# EAGLE design V0 (EAGLE 6.5.0)
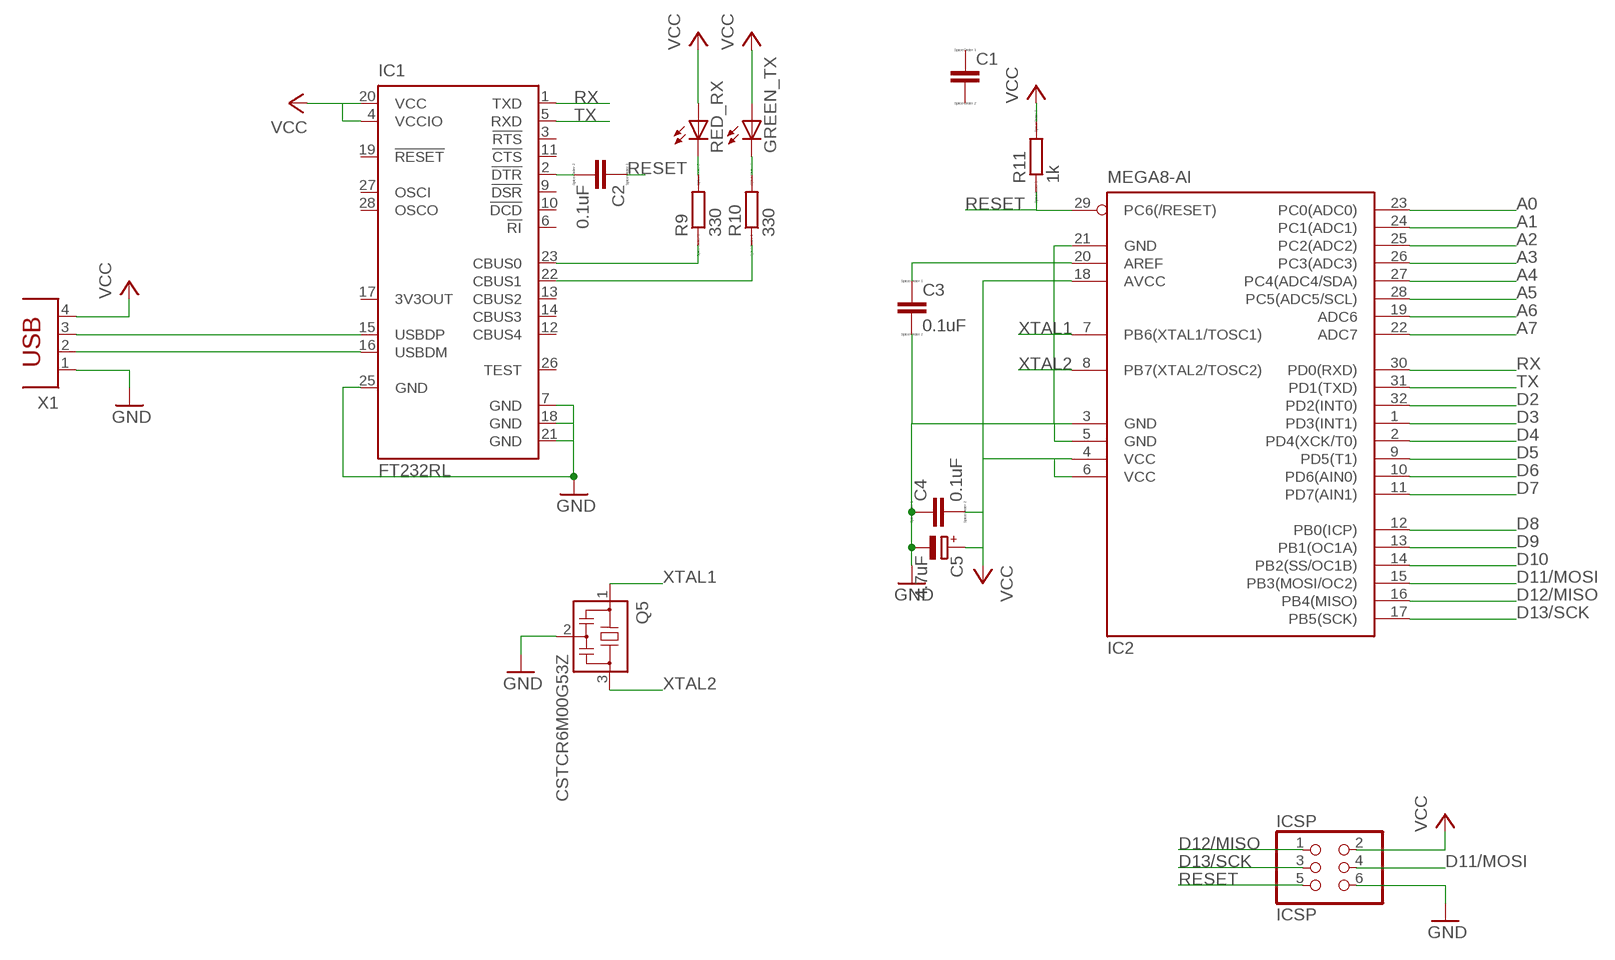
[diagram p0: schematic, sheet 1, part 1 of 2]
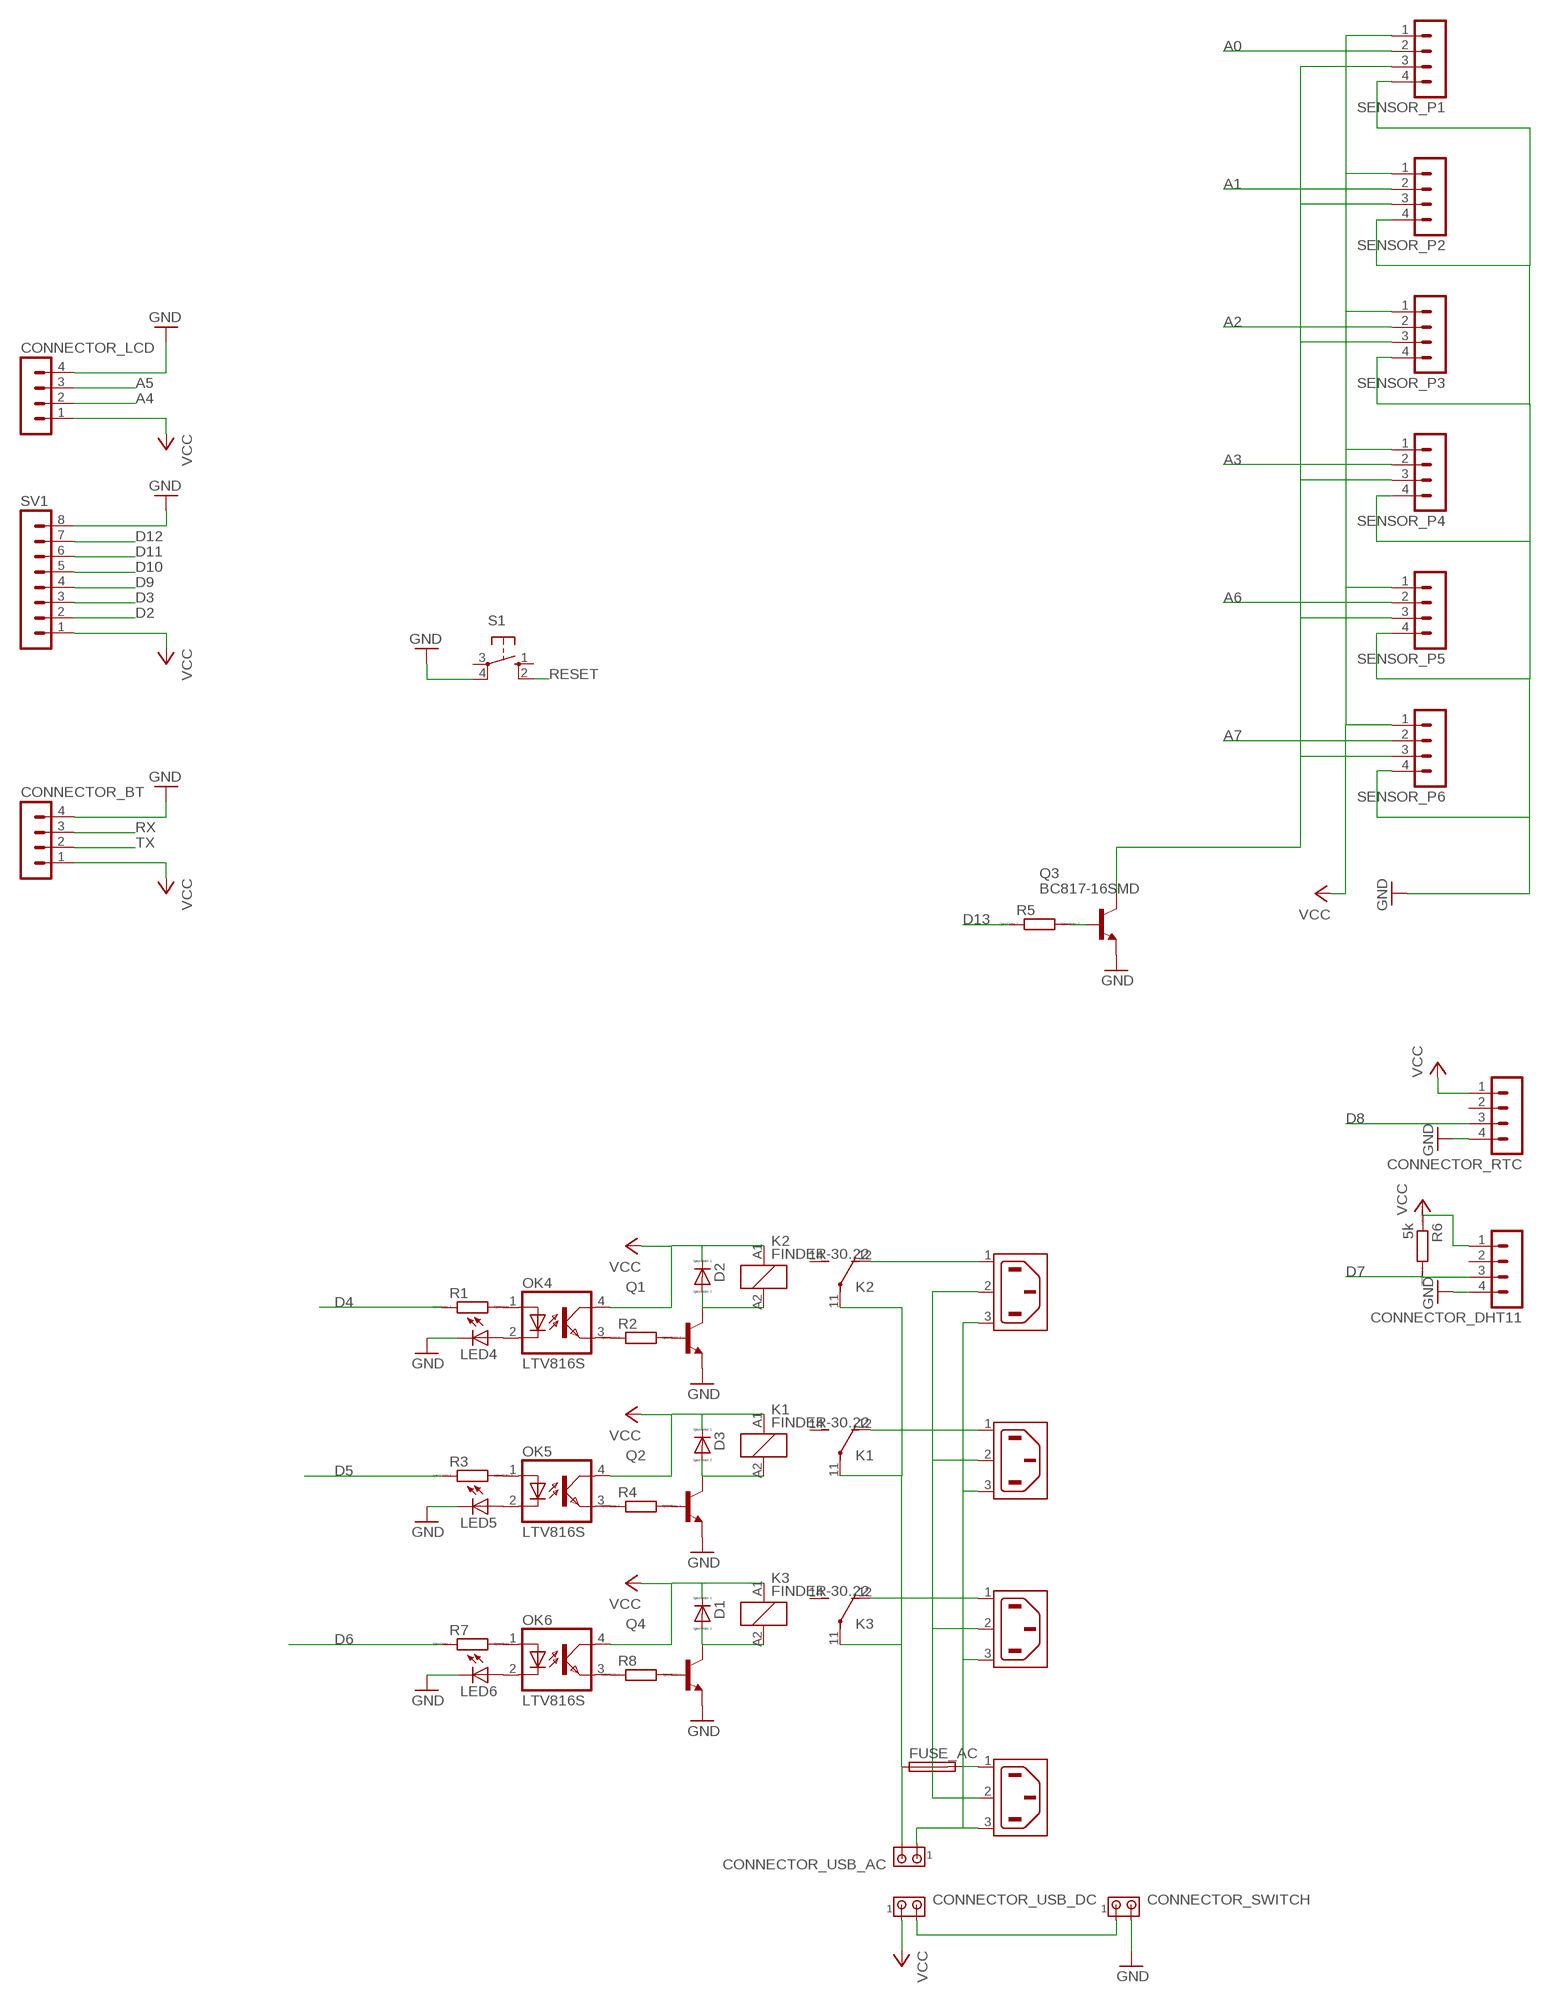
[diagram p1: schematic, sheet 1, part 2 of 2]

## Parts
C1  C  [C0805]
C2  0.1uF  C  [C0805]
C3  0.1uF  C  [C0805]
C4  0.1uF  C  [C0805]
C5  4.7uF  CPOL-EU085CS-1AW  [085CS_1AW]
CONNECTOR_BT  MA04-1  [MA04-1]
CONNECTOR_DHT11  MA04-1  [MA04-1]
CONNECTOR_LCD  MA04-1  [MA04-1]
CONNECTOR_RTC  MA04-1  [MA04-1]
CONNECTOR_SWITCH  MTA02-100  [10X02MTA]
CONNECTOR_USB_AC  MTA02-100  [10X02MTA]
CONNECTOR_USB_DC  MTA02-100  [10X02MTA]
D1  DIODE_E-  [DIODE_SMB]
D2  DIODE_E-  [DIODE_SMB]
D3  DIODE_E-  [DIODE_SMB]
FUSE_AC  SH22,5  [SH22,5]
GREEN_TX  LEDCHIPLED_0805  [CHIPLED_0805]
IC1  FT232RL  [SSOP28]
IC2  MEGA8-AI  [TQFP32-08]
ICSP  ICSP  PINHD-2X3_2.54-SMD  [2X03SMD]
IN_AC  6ESRM-P  [6ESRM-P]
K1  FINDER-30.22  [FINDER-30.22]
K2  FINDER-30.22  [FINDER-30.22]
K3  FINDER-30.22  [FINDER-30.22]
LED4  LEDCHIPLED_0805  [CHIPLED_0805]
LED5  LEDCHIPLED_0805  [CHIPLED_0805]
LED6  LEDCHIPLED_0805  [CHIPLED_0805]
OK4  LTV816S  [SMD4]
OK5  LTV816S  [SMD4]
OK6  LTV816S  [SMD4]
OUT_LIGHT  6ESRM-P  [6ESRM-P]
OUT_PUMP  6ESRM-P  [6ESRM-P]
OUT_PUMP1  6ESRM-P  [6ESRM-P]
Q1  BC847ASMD  [SOT23]
Q2  BC847ASMD  [SOT23]
Q3  BC817-16SMD  [SOT23-BEC]
Q4  BC847ASMD  [SOT23]
Q5  CSTCR6M00G53Z  [CSTCR6M]
R1  R  [R0805]
R2  R  [R0805]
R3  R  [R0805]
R4  R  [R0805]
R5  R  [R0805]
R6  5k  R  [R0805]
R7  R  [R0805]
R8  R  [R0805]
R9  330  R  [R0805]
R10  330  R  [R0805]
R11  1k  R  [R0805]
RED_RX  LEDCHIPLED_0805  [CHIPLED_0805]
S1  10-XX  [B3F-10XX]
SENSOR_P1  MA04-1  [MA04-1]
SENSOR_P2  MA04-1  [MA04-1]
SENSOR_P3  MA04-1  [MA04-1]
SENSOR_P4  MA04-1  [MA04-1]
SENSOR_P5  MA04-1  [MA04-1]
SENSOR_P6  MA04-1  [MA04-1]
SV1  MA08-1  [MA08-1]
X1  PN61729  [PN61729]

## Nets
A0: IC2.23(PC0(ADC0)) SENSOR_P1.2
A1: IC2.24(PC1(ADC1)) SENSOR_P2.2
A2: IC2.25(PC2(ADC2)) SENSOR_P3.2
A3: IC2.26(PC3(ADC3)) SENSOR_P4.2
A4: CONNECTOR_LCD.2 IC2.27(PC4(ADC4/SDA))
A5: CONNECTOR_LCD.3 IC2.28(PC5(ADC5/SCL))
A6: IC2.19(ADC6) SENSOR_P5.2
A7: IC2.22(ADC7) SENSOR_P6.2
D2: IC2.32(PD2(INT0)) SV1.2
D3: IC2.1(PD3(INT1)) SV1.3
D4: IC2.2(PD4(XCK/T0)) R1.1
D5: IC2.9(PD5(T1)) R3.1
D6: IC2.10(PD6(AIN0)) R7.1
D7: CONNECTOR_DHT11.3 IC2.11(PD7(AIN1)) R6.2
D8: CONNECTOR_RTC.3 IC2.12(PB0(ICP))
D9: IC2.13(PB1(OC1A)) SV1.4
D10: IC2.14(PB2(SS/OC1B)) SV1.5
D11: SV1.6
D11/MOSI: IC2.15(PB3(MOSI/OC2)) ICSP.4
D12: SV1.7
D12/MISO: IC2.16(PB4(MISO)) ICSP.1
D13: R5.1
D13/SCK: IC2.17(PB5(SCK)) ICSP.3
GND: C3.2 C4.1 C5.- CONNECTOR_BT.4 CONNECTOR_DHT11.4 CONNECTOR_LCD.4 CONNECTOR_RTC.4 CONNECTOR_SWITCH.2 IC1.7(GND) IC1.18(GND) IC1.21(GND) IC1.25(GND) IC2.3(GND) IC2.5(GND) IC2.21(GND) ICSP.6 LED4.C LED5.C LED6.C Q1.2(E) Q2.2(E) Q3.E Q4.2(E) Q5.2 S1.4(P1) SENSOR_P1.4 SENSOR_P2.4 SENSOR_P3.4 SENSOR_P4.4 SENSOR_P5.4 SENSOR_P6.4 SV1.8 X1.1
N$1: OK4.1(A) R1.2
N$2: OK5.1(A) R3.2
N$3: OK6.1(A) R7.2
N$4: D2.A(C) K2.A2 Q1.3(C)
N$5: R9.2 RED_RX.C
N$6: Q1.1(B) R2.2
N$7: CONNECTOR_USB_AC.2 FUSE_AC.1 K1.11(-1:P) K2.11(-1:P) K3.11(-1:P)
N$8: IN_AC.2(SH) OUT_LIGHT.2(SH) OUT_PUMP1.2(SH) OUT_PUMP.2(SH)
N$9: LED4.A OK4.2(C)
N$10: FUSE_AC.2 IN_AC.1(AC1)
N$12: LED5.A OK5.2(C)
N$13: LED6.A OK6.2(C)
N$14: D3.A(C) K1.A2 Q2.3(C)
N$15: GREEN_TX.C R10.2
N$16: Q2.1(B) R4.2
N$17: K1.12(-1:O) OUT_PUMP.1(AC1)
N$18: K2.12(-1:O) OUT_LIGHT.1(AC1)
N$19: CONNECTOR_USB_AC.1 IN_AC.3(AC2) OUT_LIGHT.3(AC2) OUT_PUMP1.3(AC2) OUT_PUMP.3(AC2)
N$24: Q3.C SENSOR_P1.3 SENSOR_P2.3 SENSOR_P3.3 SENSOR_P4.3 SENSOR_P5.3 SENSOR_P6.3
N$25: Q3.B R5.2
N$28: OK4.3(EMIT) R2.1
N$31: OK5.3(EMIT) R4.1
N$36: C2.2 IC1.2(!DTR)
N$37: IC1.23(CBUS0) R9.1
N$38: OK6.3(EMIT) R8.1
N$42: D1.A(C) K3.A2 Q4.3(C)
N$43: IC1.22(CBUS1) R10.1
N$44: Q4.1(B) R8.2
N$46: K3.12(-1:O) OUT_PUMP1.1(AC1)
N$47: CONNECTOR_SWITCH.1 CONNECTOR_USB_DC.2
N$53: IC1.15(USBDP) X1.3
N$54: IC1.16(USBDM) X1.2
N$55: C3.1
RESET: C2.1 IC2.29(PC6(/RESET)) ICSP.5 R11.1 S1.2(S1)
RX: CONNECTOR_BT.3 IC1.1(TXD) IC2.30(PD0(RXD))
TX: CONNECTOR_BT.2 IC1.5(RXD) IC2.31(PD1(TXD))
VCC: C4.2 C5.+ CONNECTOR_BT.1 CONNECTOR_DHT11.1 CONNECTOR_LCD.1 CONNECTOR_RTC.1 CONNECTOR_USB_DC.1 D1.C(A) D2.C(A) D3.C(A) GREEN_TX.A IC1.4(VCCIO) IC1.20(VCC) IC2.4(VCC) IC2.6(VCC) ICSP.2 K1.A1 K2.A1 K3.A1 OK4.4(COL) OK5.4(COL) OK6.4(COL) R6.1 R11.2 RED_RX.A SENSOR_P1.1 SENSOR_P2.1 SENSOR_P3.1 SENSOR_P4.1 SENSOR_P5.1 SENSOR_P6.1 SV1.1 X1.4
XTAL1: IC2.7(PB6(XTAL1/TOSC1)) Q5.1
XTAL2: IC2.8(PB7(XTAL2/TOSC2)) Q5.3
Unconnected: C1.1 C1.2 CONNECTOR_DHT11.2 CONNECTOR_RTC.2 IC1.3(!RTS) IC1.6(!RI) IC1.9(!DSR) IC1.10(!DCD) IC1.11(!CTS) IC1.12(CBUS4) IC1.13(CBUS2) IC1.14(CBUS3) IC1.17(3V3OUT) IC1.19(!RESET) IC1.26(TEST) IC1.27(OSCI) IC1.28(OSCO) IC2.20(AREF) K1.14(-1:S) K1.21(-2:P) K1.22(-2:O) K1.24(-2:S) K2.14(-1:S) K2.21(-2:P) K2.22(-2:O) K2.24(-2:S) K3.14(-1:S) K3.21(-2:P) K3.22(-2:O) K3.24(-2:S) S1.1(S) S1.3(P)

## Power pins joined to a net without a drawn wire
AVCC: IC2.18(AVCC)

## Library data of the parts
C1-C4 = eagle-ltspice:C: CAPACITOR, European symbol; SPICEMODEL: NONE; SPICEPREFIX: C
C5 = rcl:CPOL-EU: POLARIZED CAPACITOR, European symbol
CONNECTOR_BT CONNECTOR_DHT11 CONNECTOR_LCD CONNECTOR_RTC SENSOR_P1-SENSOR_P6 = con-lstb:MA04-1: PIN HEADER; OC_FARNELL: unknown; OC_NEWARK: unknown
CONNECTOR_SWITCH CONNECTOR_USB_AC CONNECTOR_USB_DC = con-amp:MTA02-100: AMP connector
D1-D3 = eagle-ltspice:DIODE_E-: Schottky Diode; SPICEMODEL: diode; SPICEPREFIX: D
FUSE_AC = fuse:SH22,5: FUSE HOLDER grid 22,5 mm, OGN0031 8201, Schurter (Buerklin); MF: SCHURTER; MPN: 0031.8201; OC_FARNELL: 1162740; OC_NEWARK: 96F8317
GREEN_TX LED4-LED6 RED_RX = led:LED: LED OSRAM: - CHIPLED LG R971, LG N971, LY N971, LG Q971, LY Q971, LO R971, LY R971 LH N974, LH R974 LS Q976, LO Q976, LY Q976 LO Q996 - Hyper CHIPLED LW Q18S LB Q993, LB Q99A, LB R99A - SideLED LS A670, LO A670, LY A670, LG A670, LP A670 LB A673, LV A673, LT A673, LW A673 LH A674 LY A675 LS A676, LA A676, LO A676, LY A676, LW A676 LS A679, LY A679, LG A679 - Hyper Micro SIDELED® LS Y876, LA Y876, LO Y876, LY Y876 LT Y87S - SmartLED LW L88C, LW L88S LB L89C, LB L89S, LG L890 LS L89K, LO L89K, LY L89K LS L896, LA L896, LO L896, LY L896 - TOPLED LS T670, LO T670, LY T670, LG T670, LP T670 LSG T670, LSP T670, LSY T670, LOP T670, LYG T670 LG T671, LOG T671, LSG T671 LB T673, LV T673, LT T673, LW T673 LH T674 LS T676, LA T676, LO T676, LY T676, LB T676, LH T676, LSB T676, LW T676 LB T67C, LV T67C, LT T67C, LS T67K, LO T67K, LY T67K, LW E67C LS E67B, LA E67B, LO E67B, LY E67B, LB E67C, LV E67C, LT E67C LW T67C LS T679, LY T679, LG T679 LS T770, LO T770, LY T770, LG T770, LP T770 LB T773, LV T773, LT T773, LW T773 LH T774 LS E675, LA E675, LY E675, LS T675 LS T776, LA T776, LO T776, LY T776, LB T776 LHGB T686 LT T68C, LB T68C - Hyper Mini TOPLED® LB M676 - Mini TOPLED Santana® LG M470 LS M47K, LO M47K, LY M47K Source: http://www.osram.convergy.de LUXEON: - LUMILED® LXK2-PW12-R00, LXK2-PW12-S00, LXK2-PW14-U00, LXK2-PW14-V00 LXK2-PM12-R00, LXK2-PM12-S00, LXK2-PM14-U00 LXK2-PE12-Q00, LXK2-PE12-R00, LXK2-PE12-S00, LXK2-PE14-T00, LXK2-PE14-U00 LXK2-PB12-K00, LXK2-PB12-L00, LXK2-PB12-M00, LXK2-PB14-N00, LXK2-PB14-P00, LXK2-PB14-Q00 LXK2-PR12-L00, LXK2-PR12-M00, LXK2-PR14-Q00, LXK2-PR14-R00 LXK2-PD12-Q00, LXK2-PD12-R00, LXK2-PD12-S00 LXK2-PH12-R00, LXK2-PH12-S00 LXK2-PL12-P00, LXK2-PL12-Q00, LXK2-PL12-R00 Source: www.luxeon.com KINGBRIGHT: KA-3528ASYC Source: www.kingbright.com
IC1 = ftdichip:FT232R: Source: http://www.ftdichip.com/Documents/DataSheets/DS_FT232R_v104.pdf; MPN: FT232RL; OC_FARNELL: 1146032; OC_NEWARK: 91K9918
IC2 = atmel:MEGA8: MICROCONTROLLER 8 Kbytes FLASH, 1 kbytes SRAM, 512 bytes EEPROM, USART, 6-channel 10 bit ADC, 2-channel 8 bit ADC Pin compatible with Atmega48, ATMega88, ATMega168 Source: avr.lbr; MPN: ATMEGA8-16AU; OC_FARNELL: 9171371; OC_NEWARK: 73M8863
ICSP = pinhead_smd:PINHD-2X3: PIN HEADER
IN_AC OUT_LIGHT OUT_PUMP OUT_PUMP1 = con-tycoelectronics:6ESRM-P: AC Connector 120/250 VAC Source: http://catalog.tycoelectronics.com .. ENG_DS_1654001_1099_SR_0406.pdf; MF: TYCO ELECTRONICS; MPN: 6ESRM-P; OC_FARNELL: unknown; OC_NEWARK: 87F1821
K1-K3 = relay:FINDER-30.22: SUBMINIATURE DIL-RELAIS FINDER 30.22.9.024.0000 Kontakt max. AC - 125V Distributor: Farnell Bestell Nr.: 1217371 Source: http://www.farnell.com/datasheets/87634.pdf; OC_FARNELL: unknown; OC_NEWARK: unknown
OK4-OK6 = optocoupler:LTV816: OPTO COUPLER Source: LITEON, LTV816.pdf; OC_FARNELL: unknown; OC_NEWARK: unknown
Q1 Q2 Q4 = transistor-npn:BC847*: NPN Transistor
Q3 = transistor-npn:BC817*: NPN Transistor
Q5 = murata-filter:CSTCR: Resonator Source: murata.co.jp; MPN: CSTCR6M00G53-R0; OC_FARNELL: 1170434; OC_NEWARK: 25M8759
R1-R11 = eagle-ltspice:R: RESISTOR, European symbol; SPICEMODEL: NONE; SPICEPREFIX: R
S1 = switch-omron:10-XX: OMRON SWITCH; MPN: B3F-1000; OC_FARNELL: 176432; OC_NEWARK: 36M3542
SV1 = con-lstb:MA08-1: PIN HEADER; OC_FARNELL: unknown; OC_NEWARK: unknown
X1 = con-berg:PN61729: BERG USB connector; OC_FARNELL: unknown; OC_NEWARK: unknown

## Board
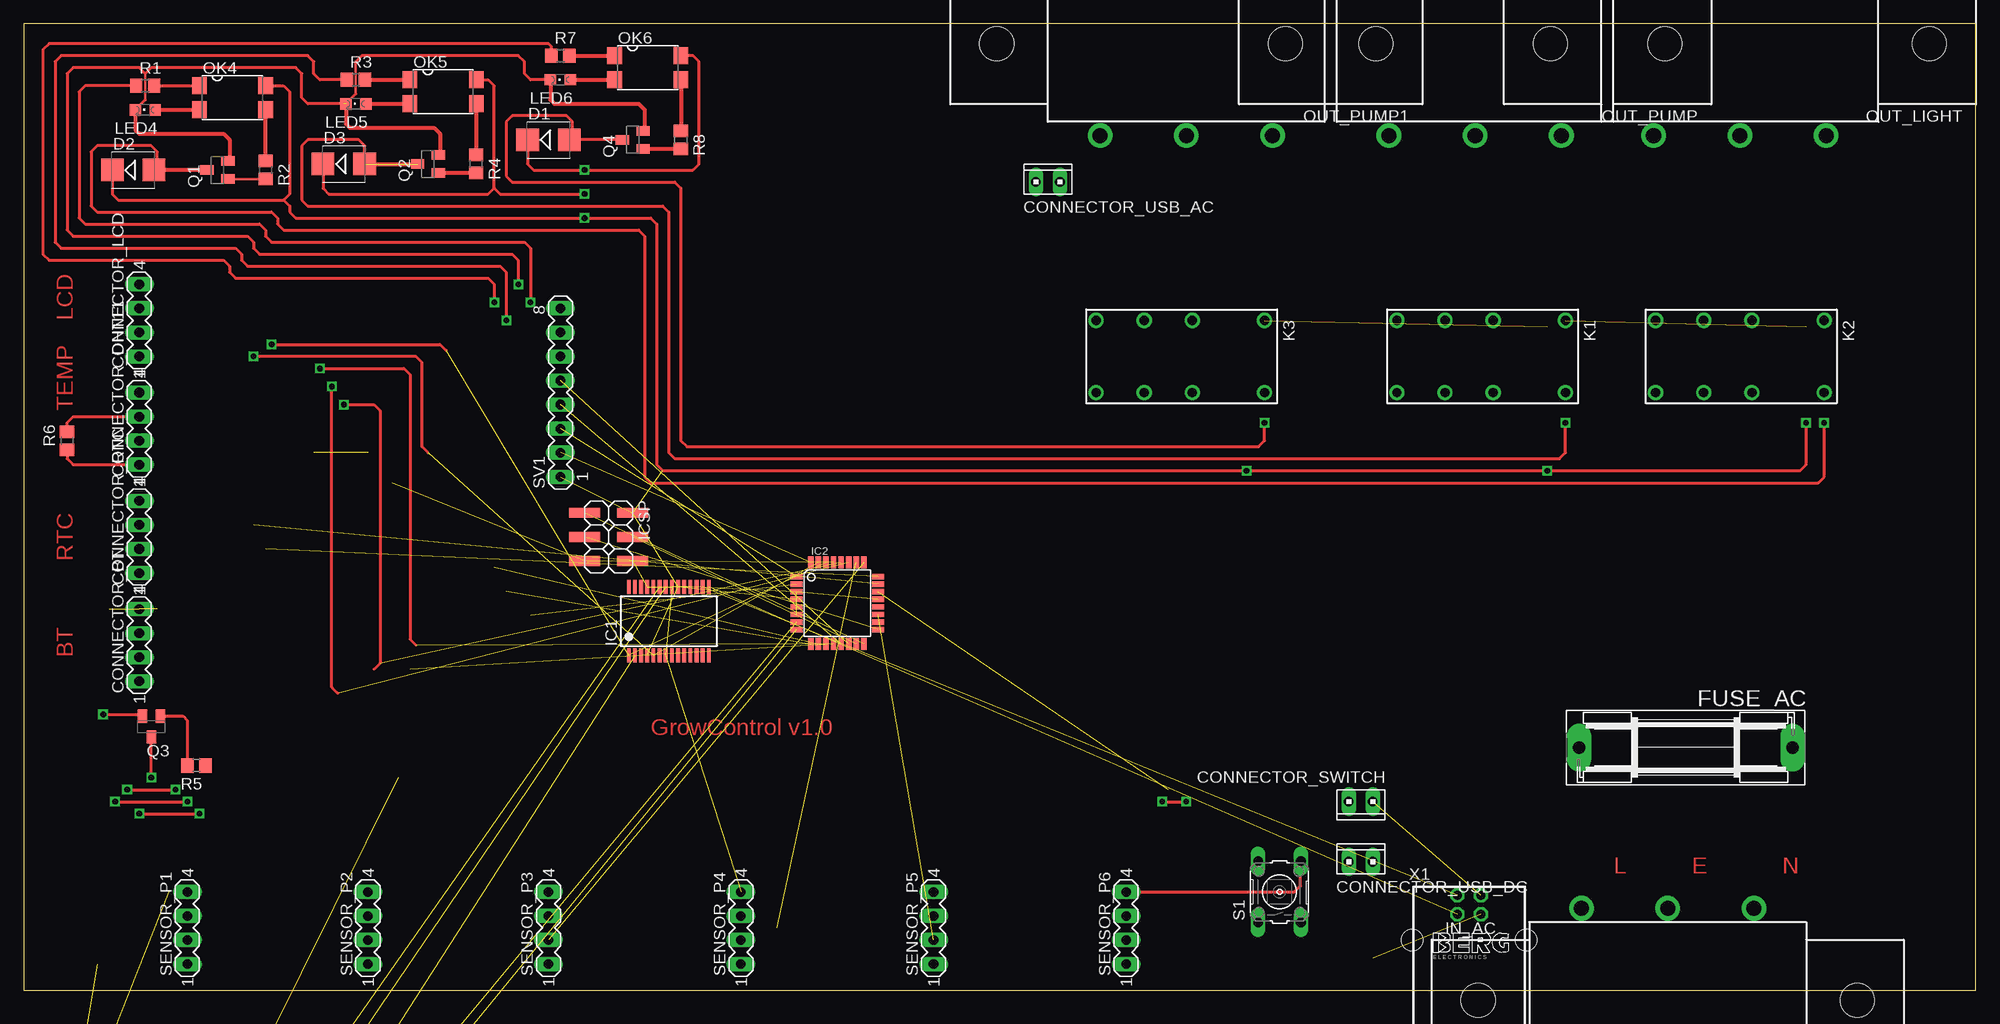
[diagram p2: board, top side]
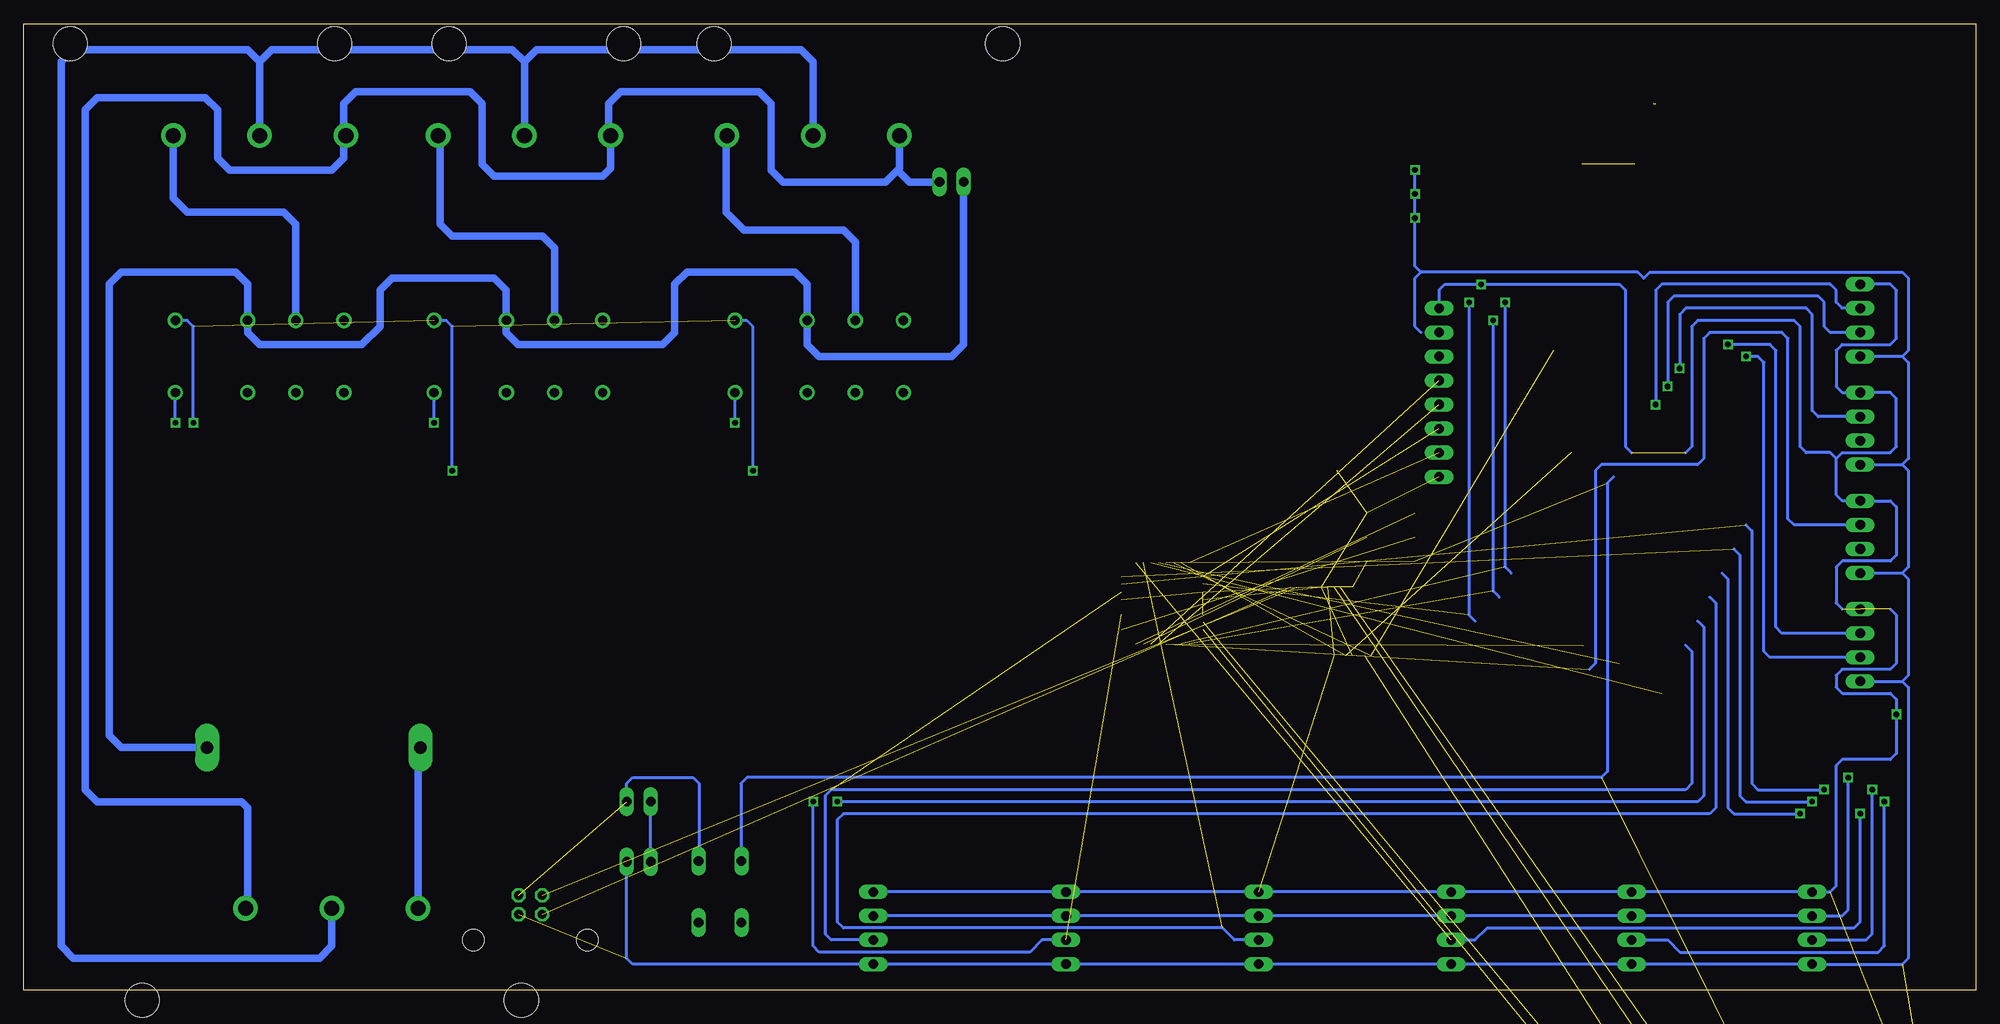
[diagram p3: board, bottom side, seen from below]

Size 206 x 102 mm. Coordinates in mm from the lower left corner, seen from the top.
Outline: 0,0 206,0 206,102 0,102 0,0
Copper layers (1*16): Top 0.035mm / dielectric 1.5mm / Bottom 0.035mm
Design rules "default": minimum track width 10mil, minimum drill 24mil, track to track 8mil, track to pad 8mil, pad to pad 8mil, via to via 8mil, smd to smd 8mil, copper to edge 40mil, drill to drill 8mil, minimum pad ring 10mil, minimum via ring 8mil, stop-mask expansion 4mil, vias tented up to drill 0mil, thermal gap 10mil

### Footprints (pad centres in the part's own frame; a part is rotated, then mirrored left to right if it is on the bottom)
C0805 = smd 1.3 x 1.5: 1 -0.95,0; 2 0.95,0
085CS_1AW = smd 4.7 x 3.7: + 4.45,0; - -4.45,0
MA04-1 = drill 1.016 long: 1 -3.81,0; 2 -1.27,0; 3 1.27,0; 4 3.81,0
10X02MTA = drill 1.016 long: 1 1.27,0; 2 -1.27,0
DIODE_SMB = smd 2.4 x 2.4: A 2.2,0; C -2.2,0
SH22,5 = drill 1.321 pad 2.54 long: 1 -11.252,0; 2 11.252,0
CHIPLED_0805 = smd 1.2 x 1.2: A 0,-1.05; C 0,1.05
SSOP28 = smd 0.4 x 1.5: 1 -4.225,-3.625; 2 -3.575,-3.625; 3 -2.925,-3.625; 4 -2.275,-3.625; 5 -1.625,-3.625; 6 -0.975,-3.625; 7 -0.325,-3.625; 8 0.325,-3.625; 9 0.975,-3.625; 10 1.625,-3.625; 11 2.275,-3.625; 12 2.925,-3.625; 13 3.575,-3.625; 14 4.225,-3.625; 15 4.225,3.625; 16 3.575,3.625; 17 2.925,3.625; 18 2.275,3.625; 19 1.625,3.625; 20 0.975,3.625; 21 0.325,3.625; 22 -0.325,3.625; 23 -0.975,3.625; 24 -1.625,3.625; 25 -2.275,3.625; 26 -2.925,3.625; 27 -3.575,3.625; 28 -4.225,3.625
TQFP32-08 = smd 1.27 x 0.559: 1 -4.293,2.8; 2 -4.293,2; 3 -4.293,1.2; 4 -4.293,0.4; 5 -4.293,-0.4; 6 -4.293,-1.2; 7 -4.293,-2; 8 -4.293,-2.8; 17 4.293,-2.8; 18 4.293,-2; 19 4.293,-1.2; 20 4.293,-0.4; 21 4.293,0.4; 22 4.293,1.2; 23 4.293,2; 24 4.293,2.8 | smd 0.559 x 1.27: 9 -2.8,-4.293; 10 -2,-4.293; 11 -1.2,-4.293; 12 -0.4,-4.293; 13 0.4,-4.293; 14 1.2,-4.293; 15 2,-4.293; 16 2.8,-4.293; 25 2.8,4.293; 26 2,4.293; 27 1.2,4.293; 28 0.4,4.293; 29 -0.4,4.293; 30 -1.2,4.293; 31 -2,4.293; 32 -2.8,4.293
2X03SMD = smd 1.016 x 3.302: 1 -1.27,-3.81; 2 -1.27,1.27; 3 1.27,-3.81; 4 1.27,1.27; 5 3.81,-3.81; 6 3.81,1.27
6ESRM-P = drill 1.6 pad 2.6: 1 -9.1,9.7; 2 0,9.7; 3 9.1,9.7 | hole 3.6: -20,0; 20,0
FINDER-30.22 = drill 1 pad 1.6: 11 -1.27,-3.81; 12 3.81,-3.81; 14 8.89,-3.81; 21 -1.27,3.81; 22 3.81,3.81; 24 8.89,3.81; A1 -8.89,-3.81; A2 -8.89,3.81
SMD4 = smd 1.78 x 1.55: 1 -1.27,-3.5; 2 1.27,-3.5; 3 1.27,3.5; 4 -1.27,3.5
SOT23 = smd 1 x 1.4: 1 -0.95,-1.1; 2 0.95,-1.1; 3 0,1.1
SOT23-BEC = smd 1 x 1.4: B -0.95,-1.1; C 0,1.1; E 0.95,-1.1
CSTCR6M = smd 0.8 x 2.6: 1 -1.5,0; 2 0,0; 3 1.5,0
R0805 = smd 1.3 x 1.5: 1 -0.95,0; 2 0.95,0
B3F-10XX = drill 1.016 long: 1 -3.251,2.261; 2 3.251,2.261; 3 -3.251,-2.261; 4 3.251,-2.261
MA08-1 = drill 1.016 long: 1 -8.89,0; 2 -6.35,0; 3 -3.81,0; 4 -1.27,0; 5 1.27,0; 6 3.81,0; 7 6.35,0; 8 8.89,0
PN61729 = drill 0.95 octagon: 1 1.25,4.71; 2 -1.25,4.71; 3 -1.25,2.71; 4 1.25,2.71 | hole 2.3: -6.02,0; 6.02,0

### Placement (x,y rotation side)
C1  2.03,-65.2 0 top  (outside the outline)
C2  -10.67,-80.44 0 top  (outside the outline)
C3  -26.54,-93.15 0 top  (outside the outline)
C4  -45.59,-99.5 0 top  (outside the outline)
C5  -43.69,-105.84 0 top  (outside the outline)
CONNECTOR_BT  12.19,36.39 90 top
CONNECTOR_DHT11  12.19,59.26 90 top
CONNECTOR_LCD  12.19,70.69 90 top
CONNECTOR_RTC  12.19,47.83 90 top
CONNECTOR_SWITCH  141.1,19.89 180 top
CONNECTOR_USB_AC  108.08,85.29 0 top
CONNECTOR_USB_DC  141.1,13.53 0 top
D1  55.38,89.73 0 top
D2  11.56,86.56 0 top
D3  33.78,87.19 0 top
FUSE_AC  175.39,25.6 180 top
GREEN_TX  -10.03,-63.94 0 top  (outside the outline)
IC1  68.08,38.94 0 top
IC2  85.86,40.84 0 top
ICSP  62.99,49.09 270 top
IN_AC  173.49,-1.07 0 top
K1  153.8,66.88 180 top
K2  181.11,66.88 180 top
K3  122.05,66.88 180 top
LED4  12.83,92.91 90 top
LED5  35.06,93.55 90 top
LED6  56.65,96.09 90 top
OK4  22.04,94.18 270 top
OK5  44.26,94.81 270 top
OK6  65.85,97.35 270 top
OUT_LIGHT  181.11,99.9 180 top
OUT_PUMP  153.16,99.9 180 top
OUT_PUMP1  122.69,99.9 180 top
Q1  20.45,86.56 90 top
Q2  42.67,87.19 90 top
Q3  13.47,27.82 180 top
Q4  64.27,89.73 90 top
Q5  -44.96,-114.74 0 top  (outside the outline)
R1  12.83,95.45 0 top
R2  25.53,86.56 270 top
R3  35.06,96.09 0 top
R4  47.76,87.19 270 top
R5  18.23,23.7 180 top
R6  4.58,57.98 90 top
R7  56.65,98.62 0 top
R8  69.34,89.73 270 top
R9  -10.67,-69.65 0 top  (outside the outline)
R10  -10.67,-74.09 0 top  (outside the outline)
R11  -26.54,-86.79 0 top  (outside the outline)
RED_RX  -3.68,-63.94 0 top  (outside the outline)
S1  132.53,10.36 90 top
SENSOR_P1  17.28,6.55 90 top
SENSOR_P2  36.33,6.55 90 top
SENSOR_P3  55.38,6.55 90 top
SENSOR_P4  75.69,6.55 90 top
SENSOR_P5  96.02,6.55 90 top
SENSOR_P6  116.34,6.55 90 top
SV1  56.65,63.06 90 top
X1  152.53,5.28 0 top

### Tracks (layer width: path | path; a pad name or v marks a point on that pad's centre or on a via)
A0  (via drill 0.6)  (1 unrouted)
  Top 0.305: v10.92,21.16 v16,21.16
  Bottom 0.305: SENSOR_P1.2 11.56,5.28 10.92,5.91 v10.92,21.16 | 24.26,49.09 23.62,48.46 23.62,21.79 22.99,21.16 v16,21.16
A1  (via drill 0.6)  (1 unrouted)
  Top 0.305: v9.66,19.89 v17.28,19.89
  Bottom 0.305: SENSOR_P2.2 32.52,5.28 31.25,4.01 10.29,4.01 9.66,4.65 v9.66,19.89 | 25.53,46.55 24.89,45.92 24.89,20.52 24.26,19.89 v17.28,19.89
A2  (via drill 0.6)  (1 unrouted)
  Top 0.305: v12.19,18.62 v18.55,18.62
  Bottom 0.305: SENSOR_P3.2 52.84,5.28 51.56,6.55 12.83,6.55 12.19,7.19 v12.19,18.62 | 26.8,44.02 26.17,43.38 26.17,19.25 25.53,18.62 v18.55,18.62
A3  (1 unrouted)
  Bottom 0.305: SENSOR_P4.2 78.23,5.28 79.5,6.55 119.51,6.55 120.14,7.19 120.14,17.98 119.51,18.62 28.07,18.62 27.44,19.25 27.44,40.84 28.07,41.48
A4  (via drill 0.6)  (1 unrouted)
  Top 0.305: 33.15,31.32 32.52,31.95 v32.52,63.7
  Bottom 0.305: CONNECTOR_LCD.2 15.37,69.41 16,70.05 16,72.59 16.64,73.22 31.88,73.22 32.52,72.59 v32.52,63.7
A5  (via drill 0.6)  (1 unrouted)
  Top 0.305: 36.96,33.86 37.59,34.49 37.59,61.16 36.96,61.8 v33.78,61.8
  Bottom 0.305: CONNECTOR_LCD.3 14.1,71.95 14.73,72.59 14.73,73.86 15.37,74.5 33.15,74.5 33.78,73.86 v33.78,61.8
A6  (via drill 0.6)  (1 unrouted)
  Top 0.305: v120.14,19.89 v122.69,19.89
  Bottom 0.305: SENSOR_P5.2 98.56,5.28 99.83,4.01 122.05,4.01 122.69,4.65 v122.69,19.89 | 29.34,38.94 28.7,38.3 28.7,20.52 29.34,19.89 v120.14,19.89
A7  (1 unrouted)
  Bottom 0.305: SENSOR_P6.2 120.78,5.28 121.41,5.91 121.41,20.52 120.78,21.16 30.61,21.16 29.97,21.79 29.97,35.76 30.61,36.39
D2  (1 unrouted)
D3  (1 unrouted)
D4  (via drill 0.6)  (1 unrouted)
  Top 0.305: R1.1 6.48,95.45 5.84,94.81 5.84,81.48 6.48,80.84 24.89,80.84 25.53,80.21 25.53,79.58 26.17,78.94 52.84,78.94 53.47,78.31 v53.47,72.59
  Bottom 0.305: v53.47,72.59 53.47,39.57 52.84,38.94
D5  (via drill 0.6)  (1 unrouted)
  Top 0.305: R3.1 31.25,96.09 30.61,96.72 30.61,97.99 29.97,98.62 3.94,98.62 3.31,97.99 3.31,78.94 3.94,78.31 22.36,78.31 22.99,77.67 22.99,77.03 23.62,76.4 50.3,76.4 50.93,75.77 v50.93,70.69
  Bottom 0.305: 50.3,41.48 50.93,42.11 v50.93,70.69
D6  (via drill 0.6)  (1 unrouted)
  Top 0.305: v49.66,72.59 49.66,74.5 49.02,75.13 22.36,75.13 21.72,75.77 21.72,76.4 21.08,77.03 2.67,77.03 2.03,77.67 2.03,99.26 2.67,99.9 55.38,99.9 55.7,99.58 R7.1
  Bottom 0.305: 49.02,44.02 49.66,44.65 v49.66,72.59
D7  (via drill 0.6)  (1 unrouted)
  Top 0.305: R6.2 4.58,59.89 5.21,60.52 CONNECTOR_DHT11.3 | v31.25,65.61 40.13,65.61 40.77,64.97 40.77,37.03 41.41,36.39
  Bottom 0.305: CONNECTOR_DHT11.3 16.64,60.52 17.28,61.16 17.28,71.32 17.91,71.95 30.61,71.95 31.25,71.32 v31.25,65.61
D8  (1 unrouted)
  Bottom 0.305: CONNECTOR_RTC.3 19.18,49.09 19.81,49.73 19.81,68.78 20.45,69.41 28.07,69.41 28.7,68.78 28.7,56.08 29.34,55.45 39.5,55.45 40.13,54.81 40.13,34.49 40.77,33.86
D9  (1 unrouted)
D10  (1 unrouted)
D11/MOSI  (1 unrouted)
D12/MISO  (1 unrouted)
D13/SCK  (1 unrouted)
GND  (via drill 0.6)  (17 unrouted)
  Top 0.254: 35.06,97.99 35.06,94.59 | 12.83,96.72 12.83,93.96
  Top 0.305: LED6.C 53.47,96.09 52.84,96.72 52.84,97.99 52.2,98.62 35.69,98.62 35.06,97.99 | 35.06,94.59 LED5.C | 33.78,93.55 29.97,93.55 29.34,94.18 29.34,96.72 28.7,97.35 13.47,97.35 12.83,96.72 12.19,97.35 5.21,97.35 4.58,96.72 4.58,80.21 5.21,79.58 23.62,79.58 24.26,78.94 24.26,78.31 24.89,77.67 51.56,77.67 52.2,77.03 v52.2,74.5 | 12.83,93.96 LED4.C | SENSOR_P6.4 134.12,10.36 134.75,10.99 134.75,13.57 S1.4 | v8.39,29.09 12.34,29.09 Q3.E
  Top 0.406: Q1.2 21.72,87.68 21.72,89.73 21.08,90.37 12.19,90.37 11.78,90.78 LED4.C | Q2.2 43.95,88.31 43.95,90.37 43.31,91 34.42,91 34,91.42 LED5.C | LED6.C 55.59,93.96 56.01,93.55 64.9,93.55 65.53,92.91 65.53,90.85 Q4.2
  Bottom 0.305: SENSOR_P6.4 SENSOR_P5.4 SENSOR_P4.4 SENSOR_P3.4 SENSOR_P2.4 SENSOR_P1.4 15.37,10.36 14.73,10.99 14.73,23.7 14.1,24.33 9.02,24.33 8.39,24.96 v8.39,29.09 8.39,30.68 9.02,31.32 14.1,31.32 14.73,31.95 14.73,33.22 14.1,33.86 9.02,33.86 8.39,34.49 8.39,39.57 9.02,40.2 | 14.73,56.08 14.73,52.27 14.1,51.63 CONNECTOR_RTC.4 9.02,51.63 8.39,51 8.39,45.92 9.02,45.28 14.1,45.28 14.73,44.65 14.73,40.84 14.1,40.2 | 14.73,56.08 14.1,56.72 9.02,56.72 8.39,57.35 8.39,62.43 9.02,63.06 CONNECTOR_DHT11.4 14.1,63.06 14.73,63.7 14.73,67.51 14.1,68.14 9.02,68.14 8.39,68.78 8.39,73.86 9.02,74.5 CONNECTOR_LCD.4 | 14.73,56.08 15.37,56.72 17.91,56.72 18.55,57.35 18.55,70.05 19.18,70.69 29.34,70.69 29.97,70.05 29.97,57.35 30.61,56.72 | 134.86,13.53 S1.4 134.75,13.65 134.75,21.79 135.38,22.43 141.74,22.43 142.37,21.79 CONNECTOR_SWITCH.2 | 36.33,56.72 36.96,57.35 36.96,73.86 37.59,74.5 v52.2,74.5 56.01,74.5 56.65,73.86 SV1.8
N$1
  Top 0.305: R1.2 OK4.1
N$2
  Top 0.406: R3.2 OK5.1
N$3
  Top 0.406: R7.2 OK6.1
N$4  (via drill 0.6)
  Top 0.305: 14.1,86.56 14.1,88.47 13.47,89.1 7.75,89.1 7.11,88.47 7.11,82.75 7.75,82.11 26.17,82.11 26.8,81.48 26.8,80.84 27.44,80.21 64.9,80.21 65.53,79.58 65.53,54.17 66.17,53.54 189.36,53.54 190,54.17 v190,59.89
  Top 0.406: Q1.3 14.1,86.56 D2.A
  Bottom 0.305: v190,59.89 K2.A2
N$5  (1 unrouted)
N$6
  Top 0.254: R2.2 Q1.1
N$7
  Bottom 0.813: FUSE_AC.1 195.71,25.6 196.98,26.87 196.98,74.5 195.71,75.77 183.64,75.77 182.38,74.5 K2.11 182.38,69.41 181.11,68.14 170.31,68.14 168.41,70.05 168.41,73.86 167.13,75.13 156.34,75.13 155.07,73.86 K1.11 155.07,69.41 153.8,68.14 138.56,68.14 137.29,69.41 137.29,74.5 136.02,75.77 124.59,75.77 123.32,74.5 K3.11 123.32,68.14 122.05,66.88 108.08,66.88 106.81,68.14 CONNECTOR_USB_AC.2
N$8
  Bottom 0.813: OUT_PUMP1.2 122.69,97.99 123.95,99.26 151.9,99.26 153.16,97.99 | 153.16,97.99 OUT_PUMP.2 | 181.11,97.99 179.83,99.26 154.44,99.26 153.16,97.99 | OUT_LIGHT.2 181.11,97.99 | 181.11,97.99 182.38,99.26 200.79,99.26 202.06,97.99 202.06,4.65 200.79,3.38 174.75,3.38 173.49,4.65 IN_AC.2
N$9
  Top 0.406: LED4.A OK4.2
N$10
  Bottom 0.813: IN_AC.1 164.38,25.35 FUSE_AC.2
N$12
  Top 0.406: LED5.A OK5.2
N$13
  Top 0.406: LED6.A OK6.2
N$14  (via drill 0.6)  (1 unrouted)
  Top 0.305: D3.A 35.98,89.12 35.37,89.73 29.97,89.73 29.34,89.1 29.34,83.38 29.97,82.75 67.44,82.75 68.08,82.11 68.08,56.72 68.71,56.08 162.06,56.08 162.69,56.72 v162.69,59.89
  Bottom 0.305: v162.69,59.89 K1.A2
N$15  (1 unrouted)
N$16
  Top 0.406: R4.2 Q2.1
N$17
  Bottom 0.813: K1.12 149.99,78.31 151.26,79.58 160.78,79.58 162.06,80.84 162.06,89.98 OUT_PUMP.1
N$18
  Bottom 0.813: OUT_LIGHT.1 190.2,83.59 188.72,82.11 178.56,82.11 177.3,80.84 K2.12
N$19
  Bottom 0.813: OUT_PUMP1.3 113.59,86.77 113.8,86.56 | 172.22,90.41 172.22,93.55 170.94,94.81 158.88,94.81 157.61,93.55 157.61,87.19 156.34,85.92 144.91,85.92 144.06,86.77 OUT_PUMP.3 144.28,90.41 144.28,93.55 143,94.81 128.4,94.81 127.13,93.55 127.13,86.56 125.86,85.29 115.06,85.29 113.8,86.56 | 172.22,90.41 OUT_LIGHT.3 | 172.22,90.41 172.22,87.83 173.49,86.56 184.28,86.56 185.55,87.83 185.55,92.91 186.82,94.18 198.25,94.18 199.52,92.91 199.52,21.16 198.25,19.89 183.01,19.89 182.38,19.25 182.38,8.84 IN_AC.3 | 113.8,86.56 112.53,85.29 CONNECTOR_USB_AC.1
N$24  (via drill 0.6)
  Top 0.305: v13.47,22.43 Q3.C
  Bottom 0.305: SENSOR_P6.3 SENSOR_P5.3 SENSOR_P4.3 SENSOR_P3.3 SENSOR_P2.3 SENSOR_P1.3 14.1,7.82 13.47,8.45 v13.47,22.43
N$25
  Top 0.305: Q3.B 16.81,28.92 17.28,28.46 R5.2
N$28
  Top 0.406: R2.1 OK4.3
N$31
  Top 0.406: OK5.3 R4.1
N$36  (1 unrouted)
N$37  (1 unrouted)
N$38
  Top 0.406: OK6.3 69.35,90.69 R8.1
N$41
  Top 0.406: 35.69,87.19 41.41,87.19
N$42  (via drill 0.6)
  Top 0.305: D1.A 57.91,89.73 | Q4.3 57.91,89.73 | 57.91,89.73 57.91,91.64 57.28,92.28 51.56,92.28 50.93,91.64 50.93,85.92 51.56,85.29 68.71,85.29 69.34,84.66 69.34,57.98 69.98,57.35 130.31,57.35 130.94,57.98 v130.94,59.89
  Bottom 0.305: v130.94,59.89 K3.A2
N$43  (1 unrouted)
N$44
  Top 0.406: Q4.1 R8.2
N$46
  Bottom 0.813: K3.12 118.24,78.94 119.51,80.21 129.99,80.21 131.89,82.11 131.89,90.09 OUT_PUMP1.1
N$47
  Bottom 0.305: CONNECTOR_USB_DC.2 CONNECTOR_SWITCH.1
N$53  (1 unrouted)
N$54  (1 unrouted)
RESET  (4 unrouted)
  Bottom 0.305: 38.23,54.17 38.86,53.54 38.86,23.06 39.5,22.43 129.67,22.43 130.31,21.79 130.31,13.65 S1.2
RX  (via drill 0.6)  (2 unrouted)
  Top 0.305: v26.17,68.14 43.95,68.14 44.58,67.51
  Bottom 0.305: CONNECTOR_BT.3 20.45,37.66 21.08,38.3 21.08,67.51 21.72,68.14 v26.17,68.14
TX  (via drill 0.6)  (2 unrouted)
  Top 0.305: 42.67,56.72 42.04,57.35 42.04,66.24 41.41,66.88 v24.26,66.88
  Bottom 0.305: CONNECTOR_BT.2 21.72,35.12 22.36,35.76 22.36,66.24 22.99,66.88 v24.26,66.88
VCC  (via drill 0.6)  (14 unrouted)
  Top 0.305: R6.1 4.58,56.08 5.21,55.45 CONNECTOR_DHT11.1 | OK6.4 70.62,98.62 71.25,97.99 71.25,87.19 70.62,86.56 v59.19,86.56 53.79,86.56 53.17,87.17 D1.C | OK5.4 49.02,96.09 49.66,95.45 49.66,84.66 | D3.C 31.58,84.63 32.2,84.02 49.02,84.02 49.66,84.66 | 49.66,84.66 50.3,84.02 v59.19,84.02 | D2.C 9.36,84 9.97,83.38 27.44,83.38 | OK4.4 27.44,95.45 28.07,94.81 28.07,84.02 27.44,83.38 | v188.09,59.89 188.09,55.45 187.45,54.81 67.44,54.81 66.81,55.45 66.81,80.84 66.17,81.48 v59.19,81.48 28.7,81.48 28.07,82.11 28.07,82.75 27.44,83.38
  Bottom 0.305: CONNECTOR_BT.1 7.75,32.59 | 7.75,32.59 7.11,33.22 7.11,43.38 7.75,44.02 | 7.75,32.59 7.11,31.95 7.11,3.38 7.75,2.74 SENSOR_P1.1 SENSOR_P2.1 SENSOR_P3.1 SENSOR_P4.1 SENSOR_P5.1 SENSOR_P6.1 141.74,2.74 142.37,3.38 CONNECTOR_USB_DC.1 | 7.75,66.88 7.11,66.24 7.11,56.08 7.75,55.45 | 7.75,66.88 CONNECTOR_LCD.1 | CONNECTOR_RTC.1 7.75,44.02 | 7.75,44.02 7.11,44.65 7.11,54.81 7.75,55.45 | CONNECTOR_DHT11.1 7.75,55.45 | 7.75,66.88 7.11,67.51 7.11,75.13 7.75,75.77 34.42,75.77 35.06,75.13 35.69,75.77 58.55,75.77 | 58.55,69.41 59.19,70.05 59.19,75.13 58.55,75.77 | v129.03,54.81 129.03,70.05 129.67,70.69 K3.A1 | v160.78,54.81 160.78,70.05 161.42,70.69 K1.A1 | v188.09,59.89 188.09,70.05 188.72,70.69 K2.A1 | 58.55,75.77 59.19,76.4 v59.19,81.48 v59.19,84.02 v59.19,86.56
XTAL1  (1 unrouted)
XTAL2  (1 unrouted)

### Text on the board
Top: LCD | TEMP | RTC | BT | GrowControl v1.0 | L | E | N